# Altium project lab4.PrjPcb
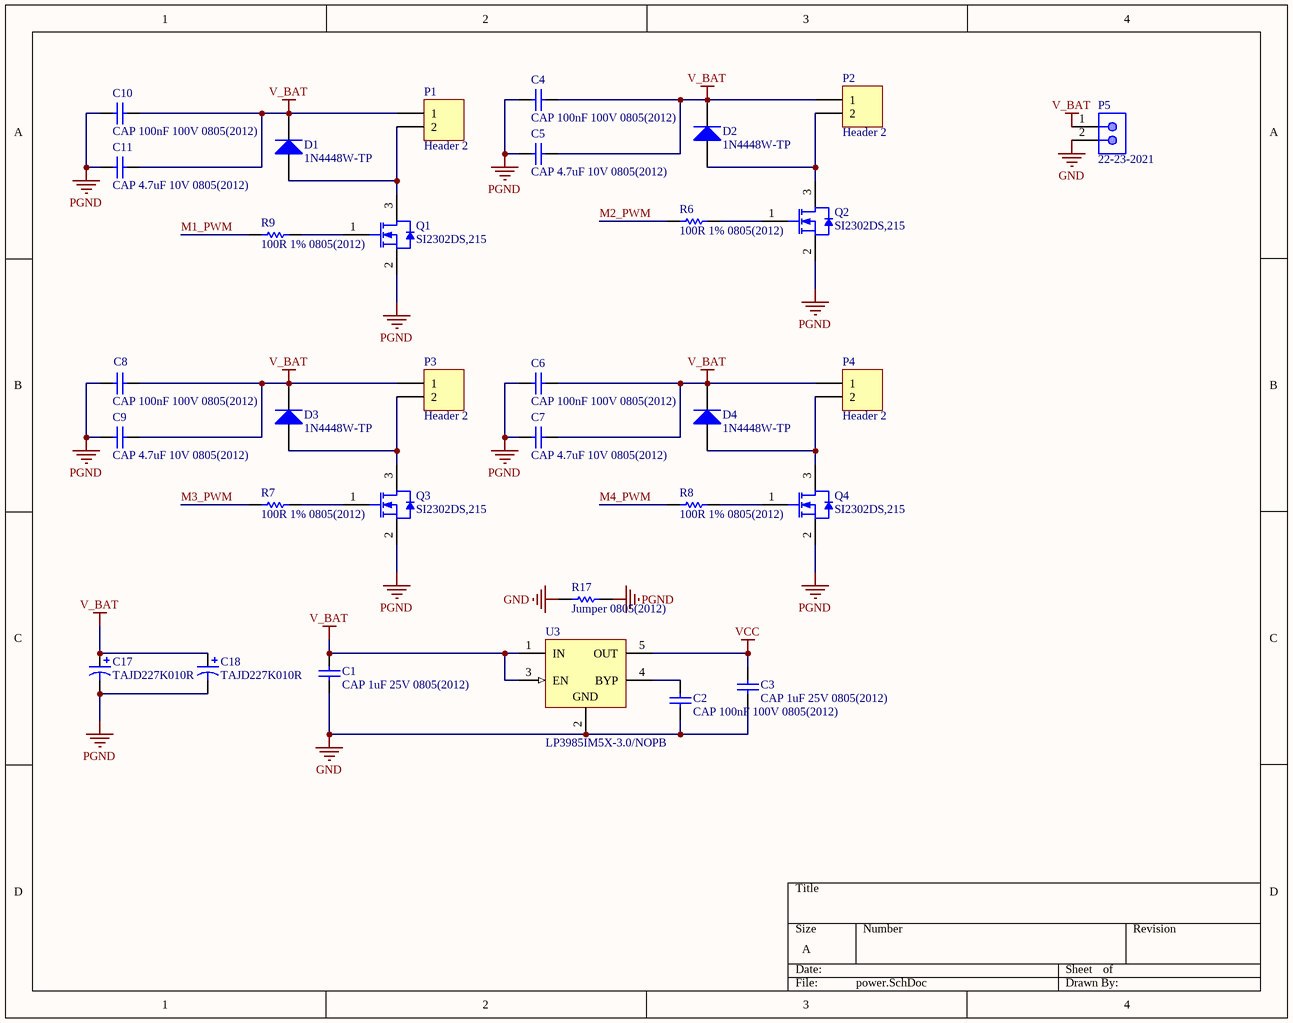
[diagram p0: power.SchDoc]
3 sheets, 68 parts. Net scope: global (net labels, ports and power ports of the same name join across sheets).
Board file: quadcopter_pcb.PcbDoc
Sheets:
  power.SchDoc
  microcontroller.SchDoc
  imu.SchDoc

## Sheet power.SchDoc
size A

### Parts
C1  CAP 1uF 25V 0805(2012)  [CAPC0805(2012)100_M]
C2  CAP 100nF 100V 0805(2012)  [CAPC0805(2012)145_N]
C3  CAP 1uF 25V 0805(2012)  [CAPC0805(2012)100_M]
C4  CAP 100nF 100V 0805(2012)  [CAPC0805(2012)145_N]
C5  CAP 4.7uF 10V 0805(2012)  [CAPC0805(2012)155_L]
C6  CAP 100nF 100V 0805(2012)  [CAPC0805(2012)145_N]
C7  CAP 4.7uF 10V 0805(2012)  [CAPC0805(2012)155_L]
C8  CAP 100nF 100V 0805(2012)  [CAPC0805(2012)145_N]
C9  CAP 4.7uF 10V 0805(2012)  [CAPC0805(2012)155_L]
C10  CAP 100nF 100V 0805(2012)  [CAPC0805(2012)145_N]
C11  CAP 4.7uF 10V 0805(2012)  [CAPC0805(2012)155_L]
C17  TAJD227K010R  [AVX-CAPC7343_V]
C18  TAJD227K010R  [AVX-CAPC7343_V]
D1  1N4448W-TP  [MCC-SOD123_V]
D2  1N4448W-TP  [MCC-SOD123_V]
D3  1N4448W-TP  [MCC-SOD123_V]
D4  1N4448W-TP  [MCC-SOD123_V]
P1  Header 2  [HDR1X2]
P2  Header 2  [HDR1X2]
P3  Header 2  [HDR1X2]
P4  Header 2  [HDR1X2]
P5  22-23-2021  [MOLX-22-23-2021_V]
Q1  SI2302DS,215  [NXP-SOT23_N]
Q2  SI2302DS,215  [NXP-SOT23_N]
Q3  SI2302DS,215  [NXP-SOT23_N]
Q4  SI2302DS,215  [NXP-SOT23_N]
R6  100R 1% 0805(2012)  [RESC0805(2012)_L]
R7  100R 1% 0805(2012)  [RESC0805(2012)_L]
R8  100R 1% 0805(2012)  [RESC0805(2012)_L]
R9  100R 1% 0805(2012)  [RESC0805(2012)_L]
R17  Jumper 0805(2012)  [RESC0805(2012)_N]
U3  LP3985IM5X-3.0/NOPB  [MF05A_L]

### Nets
GND: C1.1 C2.1 C3.1 P5.2 R17.1 U3.2(GND)
PGND: C4.1 C5.1 C6.1 C7.1 C8.1 C9.1 C10.1 C11.1 C17.2 C18.2 Q1.2(S) Q2.2(S) Q3.2(S) Q4.2(S) R17.2
V_BAT: C1.2 C4.2 C5.2 C6.2 C7.2 C8.2 C9.2 C10.2 C11.2 C17.1 C18.1 D1.2(K) D2.2(K) D3.2(K) D4.2(K) P1.1 P2.1 P3.1 P4.1 P5.1 U3.1(IN) U3.3(EN)
VCC: C3.2 U3.5(OUT)
M1_PWM: R9.1
M2_PWM: R6.1
M3_PWM: R7.1
M4_PWM: R8.1
NetC2_2: C2.2 U3.4(BYP)
NetD1_1: D1.1(A) P1.2 Q1.3(D)
NetD2_1: D2.1(A) P2.2 Q2.3(D)
NetD3_1: D3.1(A) P3.2 Q3.3(D)
NetD4_1: D4.1(A) P4.2 Q4.3(D)
NetQ1_1: Q1.1(G) R9.2
NetQ2_1: Q2.1(G) R6.2
NetQ3_1: Q3.1(G) R7.2
NetQ4_1: Q4.1(G) R8.2

### Library data of the parts
C1 C3 = CMP-1036-04754-1: CAP 1uF 25V ±10% 0805 (2012 Metric) Thickness 1mm SMD; Case-EIA: 0805; Case-Metric: 2012; Tolerance: Â±10%; Max Thickness: 1 mm; Value: 1uF; Rated Voltage: 25 V; Technology: SMT
C2 C4 C6 C8 C10 = CMP-1036-04431-1: CAP 100nF 100V ±20% 0805 (2012 Metric) Thickness 1.45mm SMD; Case-Metric: 2012; Tolerance: Â±20%; Case-EIA: 0805; Value: 100nF; Technology: SMT; Rated Voltage: 100 V; Max Thickness: 1.45 mm
C5 C7 C9 C11 = CMP-1036-04882-1: CAP 4.7uF 10V ±10% 0805 (2012 Metric) Thickness 1.55mm SMD; Case-EIA: 0805; Tolerance: Â±10%; Case-Metric: 2012; Rated Voltage: 10 V; Max Thickness: 1.55 mm; Technology: SMT; Value: 4.7uF
C17 C18 = CMP-0279-00002-2: Capacitor, Tantalum, 220uF 10% 10V MCCT-D (7343-31); Manufacturer: AVX; Polarity: Polarized; Tolerance: 10%; Rated Voltage: 10V; Technology: Tantalum; ComponentLink2Description: Datasheet; PartNumber: TAJD227K010R; ComponentLink2URL: http://www.avx.com/docs/Catalogs/taj.pdf; ComponentLink1URL: http://www.avx.com/; ComponentLink1Description: Manufacturer URL; Capacitance: 220uF; PackageDescription: 2-Pin SMT Capacitor, 7.3 x 4.3 mm Body; Mounting Technology: Surface Mount; DatasheetVersion: Jul-13; PackageReference: CAPC7343
D1-D4 = CMP-0862-00001-1: Switching Diode, 500 mW, 100 V, -55 to 150 degC, SOD123, RoHS, Tape and Reel; Manufacturer: Micro Commercial Components; FV: 1 V Max.; Trr: 4 nS; IF (AV): 250 mA; VRM (PRV): 100 V; PD: 500 mW; Typical Junction Capacitance: 4 pF; IR: 25 nA; ComponentLink1Description: Manufacturer URL; PackageVersion: Rev. C; ComponentLink2URL: http://www.mccsemi.com/up_pdf/1N4448W(SOD-123).pdf; DatasheetVersion: Rev. C; ComponentLink3Description: Package Specification; PackageDescription: 2-Pin SOD123, Body 2.7 x 1.6 mm, Height 1.35 mm; ComponentLink3URL: http://www.mccsemi.com/up_pdf/1N4448W(SOD-123).pdf; Operating Temperature Range: -55 to 150 degC; PackageReference: SOD123; PartNumber: 1N4448W-TP; Packing: Tape and Reel; ComponentLink1URL: http://www.mccsemi.com/; RoHS: TRUE; ComponentLink2Description: Datasheet; Mounting Technology: Surface Mount
P1-P4 = Header 2: Header, 2-Pin; LatestRevisionDate: 17-Jul-2002; LatestRevisionNote: Re-released for DXP Platform.; Publisher: Altium Limited
P5 = CMP-1704-00001-3: Male Header, Pitch 2.54 mm, 1 x 2 Position, Height 10.67 mm, Tail Length 3.56 mm, 0 to 75 degC, RoHS, Bulk; Package Quantity: 3000; Height: 10.67 mm; RoHSCompliant: True; ComponentLink2URL: https://datasheet.ciiva.com/19454/232266-19454304.pdf; PartNumber: 22-23-2021; Packaging: Bulk; ComponentLink2Description: Datasheet; Min Operating Temperature: 0 degC; ComponentLink1Description: Manufacturer URL; Length: 5.08 mm; Mounting Technology: Through Hole; Max Operating Temperature: 75 degC; REACH SVHC: Unknown; PackageDescription: Male Header, Pitch 2.54 mm, 1 x 2 Position, Height 10.67 mm, Tail Length 3.56 mm; ComponentLink1URL: http://www.molex.com/; Mount: Through Hole; Radiation Hardening: No; Width: 6.35 mm; Pins: 2
Q1-Q4 = CMP-1258-00133-1: N-Channel Enhancement Mode Field-Effect Transistor, 20 V, 2.5 A, 3-Pin SOT23, Tape and Reel; Manufacturer: NXP Semiconductors; Ciss [typ] (pF): 230; VDS [max] (V): 20; Channel Type: N; Coss [typ] (pF): 125; ID [max] (A): 2.5; Packing: Tape & Reel; DatasheetVersion: Rev. 02; PackageVersion: 06-03-16, 03/2006; Code_JEDEC: TO-236AB; ComponentLink3Description: Package Specification; PartNumber: SI2302DS,215; ComponentLink2URL: http://www.nxp.com/documents/data_sheet/SI2302DS.pdf; PackageDescription: 3-Pin Small Outline Transistor Package, Body 2.9 x 1.3 mm, Pitch 0.95 mm; ComponentLink2Description: Datasheet; ComponentLink1Description: Manufacturer URL; Mounting Technology: Surface Mount; ComponentLink1URL: http://www.nxp.com/; ComponentLink3URL: http://www.nxp.com/documents/outline_drawing/sot023_po.pdf; PackageReference: SOT23
R6-R9 = CMP-1013-00397-1: 100R 0.125W 1% 0805 (2012 Metric)  SMD; Value: 100.00 Ohm; Case-Metric: 2012; Case-EIA: 0805; Technology: SMT; Power: 0.125 W; Tolerance: 1 %
R17 = CMP-1013-00001-1: Jumper 0805 (2012 Metric); Case-EIA: 0805; Value: 0.00 Ohm; Tolerance: None; Case-Metric: 2012; Technology: SMT; Power: None
U3 = CMP-0062-01849-2: Micropower, 150mA Low-Noise Ultra Low-Dropout CMOS Voltage Regulator, 5-pin SOT-23, Pb-Free; Manufacturer: National Semiconductor; CompType: LDO IC; PowerWise: N; PackageTopMarking: LCRB*XTT; PackageVersion: revD, Aug-2008; DatasheetVersion: Aug-2005; ComponentLink2Description: LP3985 Web Page; RevisionNote: Component URLs added; ComponentLink3Description: MF05A Package Page; ComponentLink2URL: http://www.national.com/pf/LP/LP3985.html; ComponentLink1URL: http://www.national.com/ds/LP/LP3985.pdf; PinCount: 5; PackageDescription: Molded SOT-23, .115 x .063 x .040 in Body, 5 Lead, .0375 in Pitch; ComponentLink1Description: LP3985 Datasheet; RoHS: Y; ComponentLink3URL: http://www.national.com/packaging/folders/mf05a.html; PackageReference: MF05A

## Sheet microcontroller.SchDoc
size A
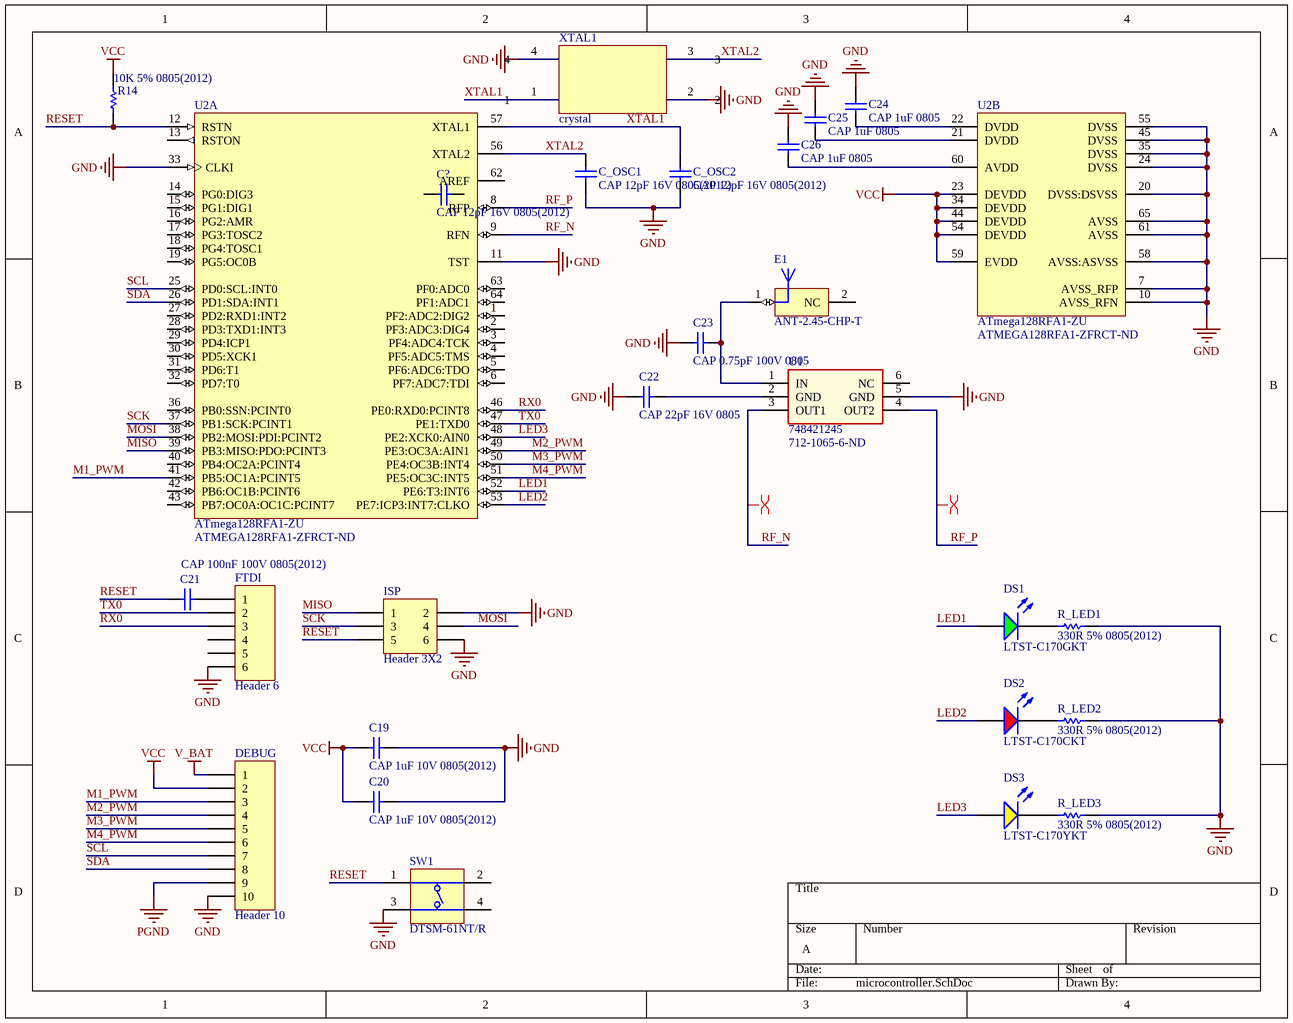
[diagram p1: microcontroller.SchDoc]

### Parts
C19  CAP 1uF 10V 0805(2012)  [CAPC0805(2012)145_N]
C20  CAP 1uF 10V 0805(2012)  [CAPC0805(2012)145_N]
C21  CAP 100nF 100V 0805(2012)  [CAPC0805(2012)145_N]
C22  CAP 22pF 16V 0805  [CAPC0805(2012)100_L]
C23  CAP 0.75pF 100V 0805  [CAPC0805(2012)100_L]
C24  CAP 1uF 0805  [CAPC0805(2012)145_N]
C25  CAP 1uF 0805  [CAPC0805(2012)145_N]
C26  CAP 1uF 0805  [CAPC0805(2012)145_N]
C?  CAP 12pF 16V 0805(2012)  [CAPC0805(2012)100_M]
C_OSC1  CAP 12pF 16V 0805(2012)  [CAPC0805(2012)100_M]
C_OSC2  CAP 12pF 16V 0805(2012)  [CAPC0805(2012)100_M]
DEBUG  Header 10  [HDR1X10]
DS1  LTST-C170GKT  [LTST-C170GKT_V]
DS2  LTST-C170CKT  [LTST-C170CKT_V]
DS3  LTST-C170YKT  [LTST-C170YKT_V]
E1  ANT-2.45-CHP-T  [ANT-2.4-CHP]
FTDI  Header 6  [HDR1X6]
ISP  Header 3X2  [HDR2X3]
R14  10K 5% 0805(2012)  [RESC0805(2012)_L]
R_LED1  330R 5% 0805(2012)  [RESC0805(2012)_L]
R_LED2  330R 5% 0805(2012)  [RESC0805(2012)_L]
R_LED3  330R 5% 0805(2012)  [RESC0805(2012)_L]
SW1  DTSM-61NT/R  [DIPT-DTSM-6_V]
U1  748421245  Supplier Part Number 1: 712-1065-6-ND  [WE-BAL_0805]
U2  ATmega128RFA1-ZU  Supplier Part Number 1: ATMEGA128RFA1-ZFRCT-ND  [64PI_N]  (parts A,B of 2)
XTAL1  crystal  [crys]

### Nets
GND: C19.1 C20.2 C22.1 C23.2 C24.2 C25.2 C26.2 C_OSC1.1 C_OSC2.1 DEBUG.10 FTDI.6 ISP.2 ISP.6 R_LED1.2 R_LED2.2 R_LED3.2 SW1.3(T3) U1.5(GND) U2.7(AVSS_RFP) U2.10(AVSS_RFN) U2.11(TST) U2.20(DVSS:DSVSS) U2.24(DVSS) U2.33(CLKI) U2.35(DVSS) U2.45(DVSS) U2.55(DVSS) U2.58(AVSS:ASVSS) U2.61(AVSS) U2.65(AVSS) XTAL1.2 XTAL1.4
PGND: DEBUG.9
V_BAT: DEBUG.1
VCC: C19.2 C20.1 DEBUG.2 R14.2 U2.23(DEVDD) U2.34(DEVDD) U2.44(DEVDD) U2.54(DEVDD) U2.59(EVDD)
LED1: DS1.1(A) U2.52(PE6:T3:INT6)
LED2: DS2.1(A) U2.53(PE7:ICP3:INT7:CLKO)
LED3: DS3.1(A) U2.48(PE2:XCK0:AIN0)
M1_PWM: DEBUG.3 U2.41(PB5:OC1A:PCINT5)
M2_PWM: DEBUG.4 U2.49(PE3:OC3A:AIN1)
M3_PWM: DEBUG.5 U2.50(PE4:OC3B:INT4)
M4_PWM: DEBUG.6 U2.51(PE5:OC3C:INT5)
MISO: ISP.1 U2.39(PB3:MISO:PDO:PCINT3)
MOSI: ISP.4 U2.38(PB2:MOSI:PDI:PCINT2)
RESET: C21.1 ISP.5 R14.1 SW1.1(T1) U2.12(RSTN)
RF_N: U1.3(OUT1) U2.9(RFN)
RF_P: U1.4(OUT2) U2.8(RFP)
RX0: FTDI.3 U2.46(PE0:RXD0:PCINT8)
SCK: ISP.3 U2.37(PB1:SCK:PCINT1)
SCL: DEBUG.7 U2.25(PD0:SCL:INT0)
SDA: DEBUG.8 U2.26(PD1:SDA:INT1)
TX0: FTDI.2 U2.47(PE1:TXD0)
XTAL1: C_OSC2.2 U2.57(XTAL1) XTAL1.1
XTAL2: C_OSC1.2 U2.56(XTAL2) XTAL1.3
NetC21_2: C21.2 FTDI.1
NetC22_2: C22.2 U1.2(GND)
NetC23_1: C23.1 E1.1(FEED) U1.1(IN)
NetC24_1: C24.1 U2.22(DVDD)
NetC25_1: C25.1 U2.21(DVDD)
NetC26_1: C26.1 U2.60(AVDD)
NetDS1_2: DS1.2(K) R_LED1.1
NetDS2_2: DS2.2(K) R_LED2.1
NetDS3_2: DS3.2(K) R_LED3.1

Not connected (* = marked no-connect by the designer): C? 1 2; E1 2(NC); FTDI 4 5; SW1 2(T2) 4(T3); U1 6(NC); U2 1(PF2:ADC2:DIG2) 2(PF3:ADC3:DIG4) 3(PF4:ADC4:TCK) 4(PF5:ADC5:TMS) 5(PF6:ADC6:TDO) 6(PF7:ADC7:TDI) 13(RSTON) 14(PG0:DIG3) 15(PG1:DIG1) 16(PG2:AMR) 17(PG3:TOSC2) 18(PG4:TOSC1) 19(PG5:OC0B) 27(PD2:RXD1:INT2) 28(PD3:TXD1:INT3) 29(PD4:ICP1) 30(PD5:XCK1) 31(PD6:T1) 32(PD7:T0) 36(PB0:SSN:PCINT0) 40(PB4:OC2A:PCINT4) 42(PB6:OC1B:PCINT6) 43(PB7:OC0A:OC1C:PCINT7) 62(AREF) 63(PF0:ADC0) 64(PF1:ADC1)

### Layout directives
differential pair: RF_N, RF_P

### Library data of the parts
C19 C20 C24-C26 = CMP-1036-04738-1: CAP 1uF 10V ±10% 0805 (2012 Metric) Thickness 1.45mm SMD; Case-EIA: 0805; Tolerance: Â±10%; Case-Metric: 2012; Max Thickness: 1.45 mm; Value: 1uF; Rated Voltage: 10 V; Technology: SMT
C21 = CMP-1036-04431-1: as C2 on sheet power; Value: 100nF; Technology: SMT; Rated Voltage: 100 V; Max Thickness: 1.45 mm
C22 = CMP-1036-01214-1: CAP 22pF 16V ±0.25pF 0805 (2012 Metric) Thickness 1mm SMD; Case-EIA: 0805; Tolerance: Â±0.25pF; Case-Metric: 2012; Technology: SMT; Value: 22pF; Max Thickness: 1 mm; Rated Voltage: 16 V
C23 = CMP-1036-00042-1: CAP 0.75pF 100V ±0.5pF 0805 (2012 Metric) Thickness 1mm SMD; Case-EIA: 0805; Tolerance: Â±0.5pF; Case-Metric: 2012; Max Thickness: 1 mm; Technology: SMT; Rated Voltage: 100 V; Value: 0.75pF
C? C_OSC1 C_OSC2 = CMP-1036-00926-1: CAP 12pF 16V ±0.5pF 0805 (2012 Metric) Thickness 1mm SMD; Case-EIA: 0805; Case-Metric: 2012; Tolerance: Â±0.5pF; Technology: SMT; Max Thickness: 1 mm; Rated Voltage: 16 V; Value: 12pF
DEBUG = Header 10: Header, 10-Pin; LatestRevisionDate: 17-Jul-2002; LatestRevisionNote: Re-released for DXP Platform.; Publisher: Altium Limited
DS1 = CMP-1674-00002-5: LED Uni-Color Green, 100 mW, 120 mA, -55 to 85 degC, 2-Pin SMD, RoHS, Tape and Reel; Manufacturer: Lite-On; ComponentLink1URL: http://www.us.liteon.com/; Height: 1.1 mm; PackageDescription: 2-Pin Surface Mount Device, Body 2 x 1.25 mm; RoHSCompliant: true; Package Quantity: 1; Packaging: Tape and Reel; Mount: Surface Mount; Min Operating Temperature: -55 degC; DatasheetVersion: 03/2003; Max Operating Temperature: 85 degC; ComponentLink1Description: Manufacturer URL; Pins: 2; Mounting Technology: Surface Mount; Length: 2 mm; Colour: Green; PackageReference: C170GKT; ComponentLink2URL: http://media.digikey.com/pdf/Data%20Sheets/Lite-On%20PDFs/LTST-C170GKT.pdf; ComponentLink2Description: Datasheet
DS2 = CMP-1674-00001-5: LED Uni-Color Red, 100 mW, 200 mA, -55 to 85 degC, 2-Pin SMD, RoHS, Tape and Reel; Manufacturer: Lite-On; ComponentLink1Description: Manufacturer URL; PackageReference: C170CKT; Package Quantity: 3000; Packaging: Tape and Reel; Pins: 2; ComponentLink2URL: http://media.digikey.com/pdf/Data%20Sheets/Lite-On%20PDFs/LTST-C170CKT.pdf; Max Operating Temperature: 85 degC; Min Operating Temperature: -55 degC; ComponentLink1URL: http://www.us.liteon.com/; Mounting Technology: Surface Mount; Mount: Surface Mount; Length: 2 mm; ComponentLink2Description: Datasheet; DatasheetVersion: 03/2003; Height: 1.1 mm; PackageDescription: 2-Pin Surface Mount Device, Body 2 x 1.25 mm; RoHSCompliant: true; Colour: Red
DS3 = CMP-1674-00003-5: LED Uni-Color Yellow, 60 mW, 80 mA, -55 to 85 degC, 2-Pin SMD, RoHS, Tape and Reel; Manufacturer: Lite-On; Mounting Technology: Surface Mount; Height: 1.1 mm; Mount: Surface Mount; Packaging: Tape and Reel; Length: 2 mm; RoHSCompliant: true; Colour: Yellow; Max Operating Temperature: 85 degC; PackageReference: C170YKT; ComponentLink1Description: Manufacturer URL; Min Operating Temperature: -55 degC; ComponentLink1URL: http://www.us.liteon.com/; DatasheetVersion: 03/2000; PackageDescription: 2-Pin Surface Mount Device, Body 2 x 1.25 mm; ComponentLink2URL: http://media.digikey.com/pdf/Data Sheets/Lite-On PDFs/LTST-C170YKT.pdf; Package Quantity: 3000; ComponentLink2Description: Datasheet; Pins: 2
E1 = CMP-0172-00025-1: 1/4-wave Monopole Ultra-Compact Chip Antenna, CHP Series, 2.4GHz, Tape and Reel; Note2: Pin 1 is feed terminal, Pin 2 is for physical support only.; PCB_Layout: Complies with manufacturer's recommendation.; Note1: No ground planes or traces under the antenna; PackageDescription: SMD Ceramic Antenna, CHP Series, 2.45MHz, 2-Leads, 6.5 x 2.2 x 1.0 mm Body; PackageReference: ANT-2.4-CHP; PackageVersion: Jan-2009; DatasheetVersion: Jan-2009
FTDI = Header 6: Header, 6-Pin; LatestRevisionDate: 17-Jul-2002; LatestRevisionNote: Re-released for DXP Platform.; Publisher: Altium Limited
ISP = Header 3X2: Header, 3-Pin, Dual row; LatestRevisionDate: 17-Jul-2002; LatestRevisionNote: Re-released for DXP Platform.; Publisher: Altium Limited
R14 = CMP-1013-00098-1: 10K 0.125W 5% 0805 (2012 Metric)  SMD; Case-EIA: 0805; Case-Metric: 2012; Value: 10000.00 Ohm; Power: 0.125 W; Technology: SMT; Tolerance: 5 %
R_LED1-R_LED3 = CMP-1013-00062-1: 330R 0.125W 5% 0805 (2012 Metric)  SMD; Value: 330.00 Ohm; Case-EIA: 0805; Case-Metric: 2012; Tolerance: 5 %; Power: 0.125 W; Technology: SMT
SW1 = CMP-0306-00001-1: Switch, SPNO Push Button SMD; Manufacturer: Diptronics; Packing Type: Tape&Reel; Mechanical Life: 200,000 cycles; ComponentLink2URL: http://www.dip.com.tw/Products_tact.htm; ComponentLink1URL: http://www.dip.com.tw/; ComponentLink3URL: http://www.dip.com.tw/PDF/pro_tact/DTSM_G_-6_2_-V.pdf; PackageDescription: Switch, Through-Hole, 4 Leads, Body 8.5x8.5mm, Row Spacing 9.0mm, Pitch 4.5mm; ComponentLink2Description: Datasheet; ComponentLink3Description: Package Specification; ComponentLink1Description: Manufacturer URL; PackageReference: DTSM-6; PartNumber: DTSM-61NT/R; Mounting Technology: Through Hole
U1 = 748421245: WE-BAL Multilayer Chip Balun, size 0805; BalancedImpedance: 100Ω; Frequence: 2400-2500MHz; PublishedDate: Aug 2016; Publisher: Wurth Elektronik; ComponentLink1Description: Manufacturer; ComponentLink1URL: http://www.we-online.de; ComponentLink2Description: Datasheet; ComponentLink2URL: http://katalog.we-online.de/pbs/datasheet/748421245.pdf; PartNumber: 748421245; Size: 0805; Supplier 1: Digikey
U2 = CMP-0107-00010-2: 8-bit AVR Microcontroller with Low Power 2.4GHz Transceiver for ZigBee and IEEE 802.15.4, 64-Pin VQFN (Sawn) (PI64), Industrial (-40°C to 85°C); Timers: 6; Transmit Current Consumption (mA): 18.6; Power Output (dBm): 3.5; UART: 1; External PA Control: Yes; Receive Current Consumption (mA): 16.6; Max. Operating Frequency: 16 MHz; Max I/O Pins: 38; ADC Resolution (bits): 10; Max Data Rate (Mb/s): 2; ADC channels: 8; Operating Voltage (Vcc): 1.8 to 3.6; Receiver Sensitivity (dBm): -100; Crypto Engine: AES; Flash (Kbytes): 128 Kbytes; EEPROM (Bytes): 4096; SRAM (Kbytes): 16; Link Budget (dBm): 103.5; PackageDescription: 64-Pin Quad Flat No-Lead (QFN), 9 x 9 mm Body, 0.5 mm Pitch, 5.65 x 4.75 mm Exposed Pad; Frequency Band: 2.4 GHz; PackageReference: 64PI; PackageVersion: revA, Feb-2008; RevisionNote: Updated to Oct-2011 datasheet, symbol revised, parameters added; ComponentLink1Description: Manufacturer URL; ComponentLink2URL: http://www.atmel.com/Images/doc8266.pdf; ComponentLink2Description: Datasheet; ComponentLink1URL: http://www.atmel.com/; SPI: 1; DatasheetVersion: rev C, Oct-2011; Antenna Diversity: Yes; Analog Comparators: 1; TWI (I2C): 1; PartId: 1; Supplier 1: Digikey

## Sheet imu.SchDoc
size A
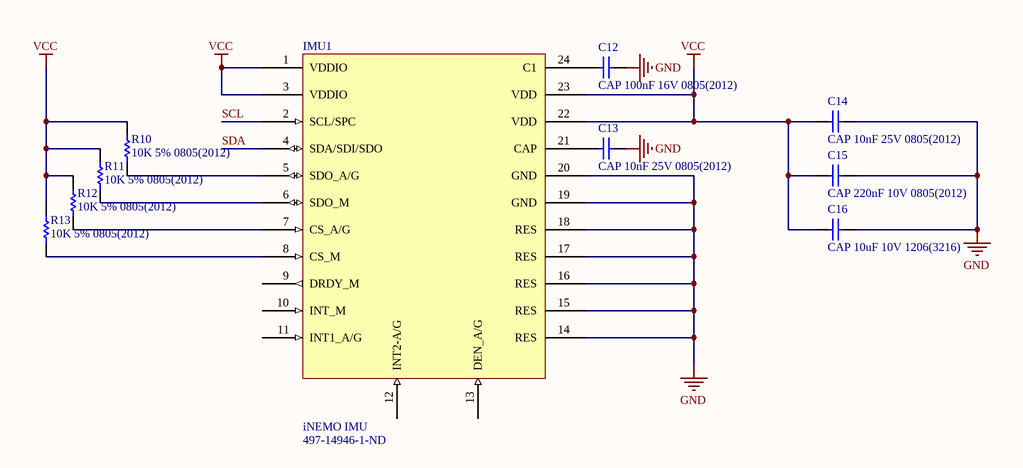
[diagram p2: imu.SchDoc]

### Parts
C12  CAP 100nF 16V 0805(2012)  [CAPC0805(2012)145_M]
C13  CAP 10nF 25V 0805(2012)  [CAPC0805(2012)100_L]
C14  CAP 10nF 25V 0805(2012)  [CAPC0805(2012)100_L]
C15  CAP 220nF 10V 0805(2012)  [CAPC0805(2012)75_N]
C16  CAP 10uF 10V 1206(3216)  [CAPC1206(3216)130_L]
IMU1  iNEMO IMU  Supplier Part Number 1: 497-14946-1-ND  [LGA-24]
R10  10K 5% 0805(2012)  [RESC0805(2012)_L]
R11  10K 5% 0805(2012)  [RESC0805(2012)_L]
R12  10K 5% 0805(2012)  [RESC0805(2012)_L]
R13  10K 5% 0805(2012)  [RESC0805(2012)_L]

### Nets
GND: C12.2 C13.2 C14.2 C15.1 C16.2 IMU1.14(RES) IMU1.15(RES) IMU1.16(RES) IMU1.17(RES) IMU1.18(RES) IMU1.19(GND) IMU1.20(GND)
VCC: C14.1 C15.2 C16.1 IMU1.1(VDDIO) IMU1.3(VDDIO) IMU1.22(VDD) IMU1.23(VDD) R10.2 R11.2 R12.2 R13.2
SCL: IMU1.2(SCL/SPC)
SDA: IMU1.4(SDA/SDI/SDO)
NetC12_1: C12.1 IMU1.24(C1)
NetC13_1: C13.1 IMU1.21(CAP)
NetIMU1_5: IMU1.5(SDO_A/G) R10.1
NetIMU1_6: IMU1.6(SDO_M) R11.1
NetIMU1_7: IMU1.7(CS_A/G) R12.1
NetIMU1_8: IMU1.8(CS_M) R13.1

Not connected (* = marked no-connect by the designer): IMU1 9(DRDY_M) 10(INT_M) 11(INT1_A/G) 12(INT2-A/G) 13(DEN_A/G)

### Library data of the parts
C12 = CMP-1036-04404-1: CAP 100nF 16V ±20% 0805 (2012 Metric) Thickness 1.45mm SMD; Case-Metric: 2012; Case-EIA: 0805; Tolerance: Â±20%; Rated Voltage: 16 V; Max Thickness: 1.45 mm; Value: 100nF; Technology: SMT
C13 C14 = CMP-1036-03826-1: CAP 10nF 25V ±2% 0805 (2012 Metric) Thickness 1mm SMD; Tolerance: Â±2%; Case-EIA: 0805; Case-Metric: 2012; Technology: SMT; Rated Voltage: 25 V; Value: 10nF; Max Thickness: 1 mm
C15 = CMP-1036-04526-1: CAP 220nF 10V ±20% 0805 (2012 Metric) Thickness 0.75mm SMD; Tolerance: Â±20%; Case-EIA: 0805; Case-Metric: 2012; Rated Voltage: 10 V; Max Thickness: 0.75 mm; Technology: SMT; Value: 220nF
C16 = CMP-1037-04970-1: CAP 10uF 10V -20% to +80% 1206 (3216 Metric) Thickness 1.3mm SMD; Case-Metric: 3216; Case-EIA: 1206; Value: 10uF; Rated Voltage: 10 V; Technology: SMT; Max Thickness: 1.3 mm; Tolerance: -20% to +80%
IMU1 = LSM9DS1: Supplier 1: Digikey
R10-R13 = CMP-1013-00098-1: as R14 on sheet microcontroller; Power: 0.125 W; Technology: SMT; Tolerance: 5 %

## Nets that join several sheets
GND: power (6 pins), microcontroller (32 pins), imu (12 pins)
PGND: power (15 pins), microcontroller (DEBUG.9)
V_BAT: power (22 pins), microcontroller (DEBUG.1)
VCC: power (C3.2 U3.5), microcontroller (9 pins), imu (11 pins)
M1_PWM: power (R9.1), microcontroller (DEBUG.3 U2.41)
M2_PWM: power (R6.1), microcontroller (DEBUG.4 U2.49)
M3_PWM: power (R7.1), microcontroller (DEBUG.5 U2.50)
M4_PWM: power (R8.1), microcontroller (DEBUG.6 U2.51)
SCL: microcontroller (DEBUG.7 U2.25), imu (IMU1.2)
SDA: microcontroller (DEBUG.8 U2.26), imu (IMU1.4)